# Altium schematic sheet Page E_Micro_SD.SchDoc
size 386 x 246 mm; SheetNumber: 0; SheetTotal: 0
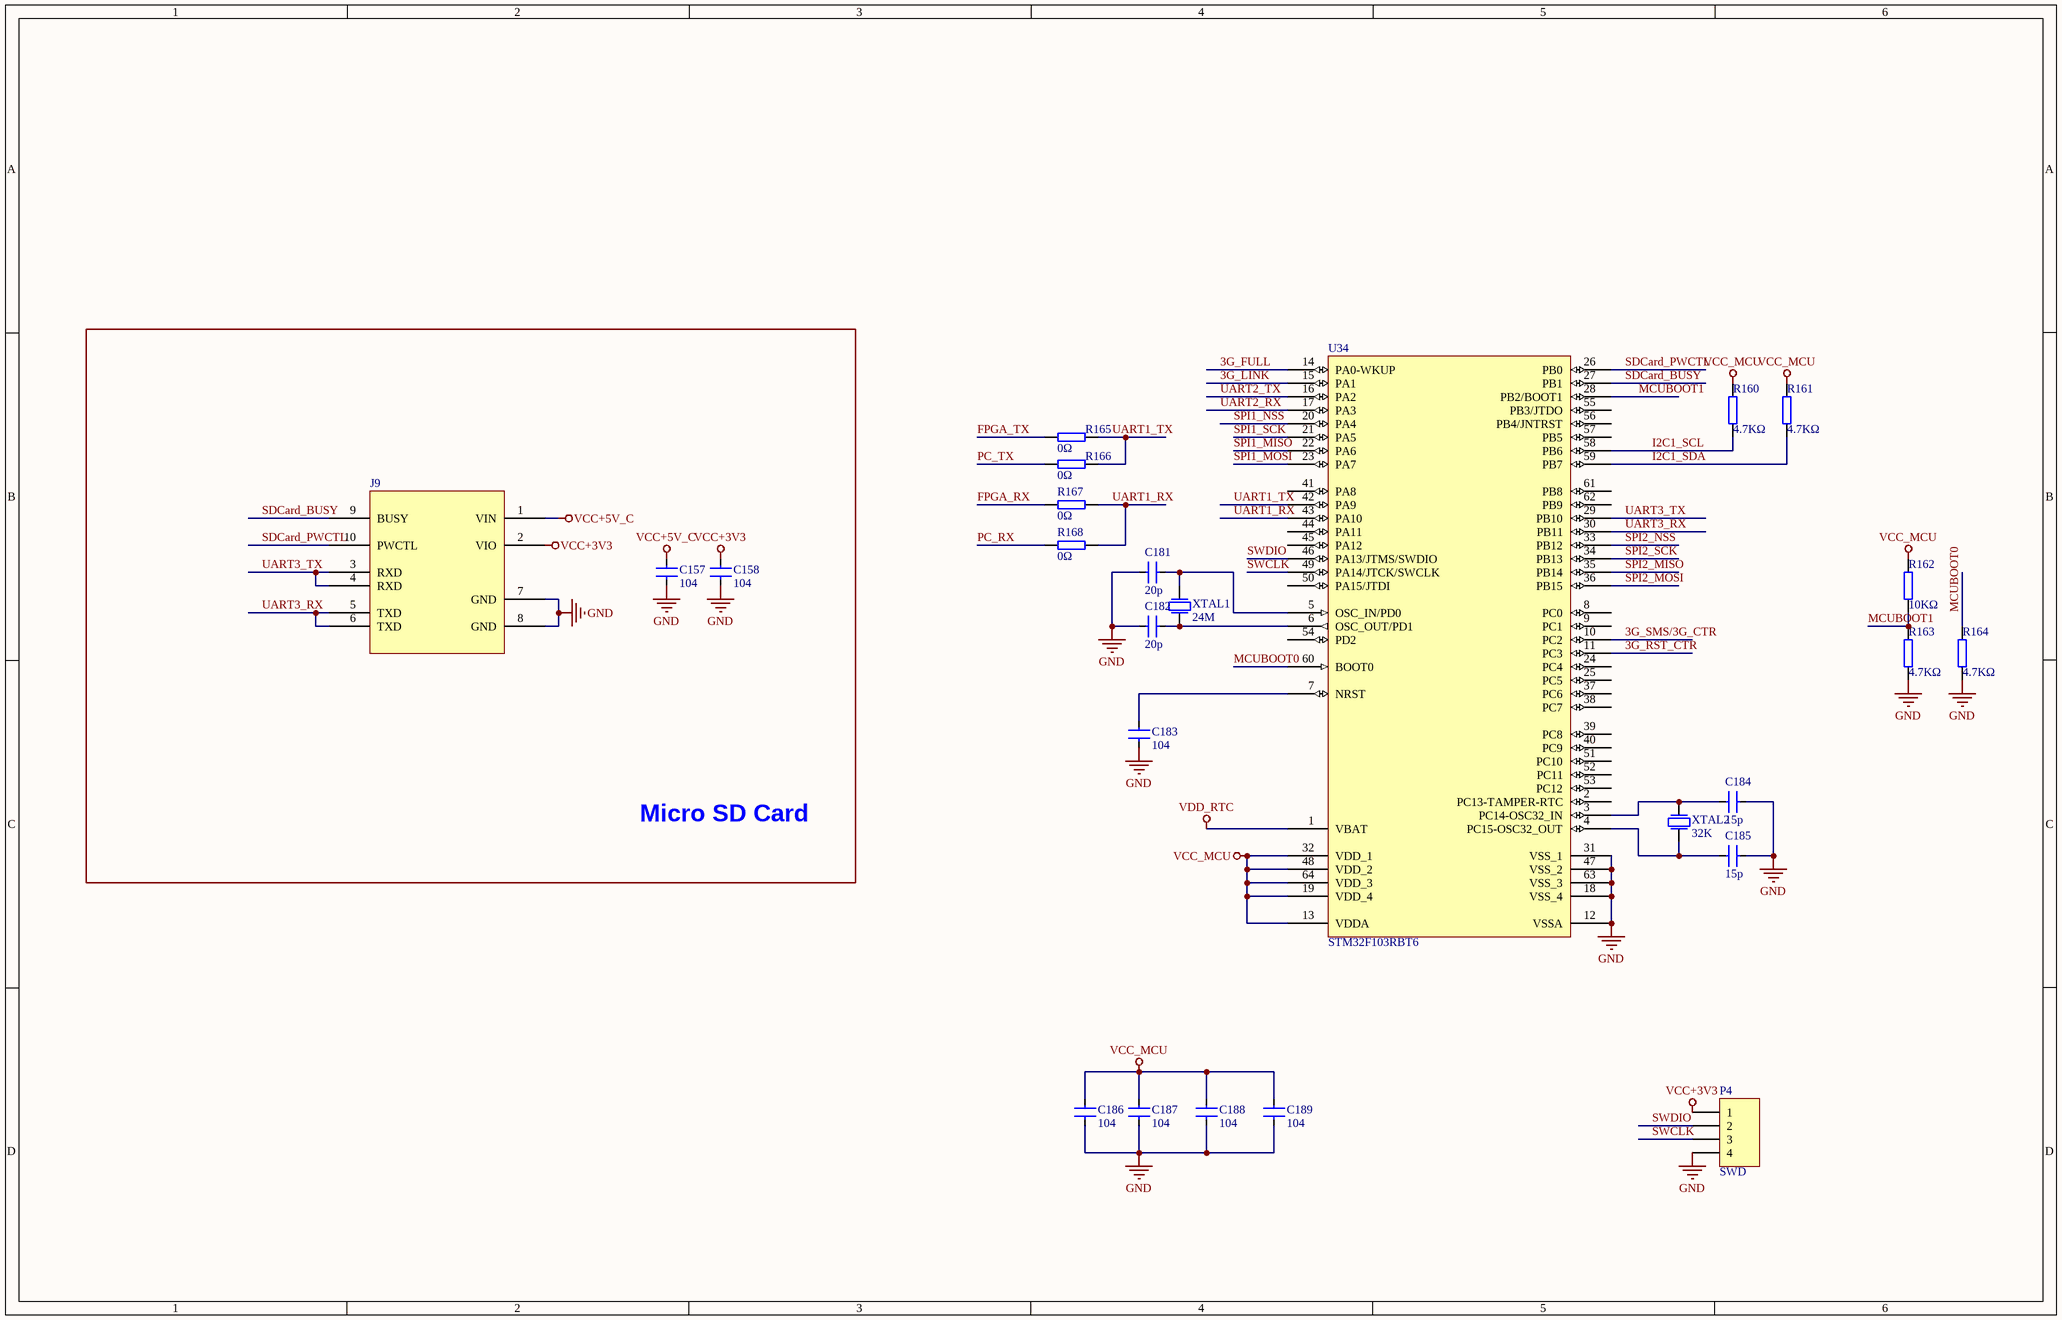
[diagram p0: Page E_Micro_SD.SchDoc]

## Parts
C157  104  [0603C]
C158  104  [0603C]
C181  20p  [0603C]
C182  20p  [0603C]
C183  104  [0603C]
C184  15p  [0603C]
C185  15p  [0603C]
C186  104  [0603C]
C187  104  [0603C]
C188  104  [0603C]
C189  104  [0603C]
J9  SDV600  [JTAG10PW]  (value not drawn)
P4  SWD  [HDR1X4]
R160  4.7KΩ  [0603R]
R161  4.7KΩ  [0603R]
R162  10KΩ  [0603R]
R163  4.7KΩ  [0603R]
R164  4.7KΩ  [0603R]
R165  0Ω  [0603R]
R166  0Ω  [0603R]
R167  0Ω  [0603R]
R168  0Ω  [0603R]
U34  STM32F103RBT6  [LQFP64_N]
XTAL1  24M  [XTAL2]
XTAL2  32K  [XTAL_32.768]

## Blocks framed on the sheet
Micro SD Card: C157 C158 J9

## Nets
GND: C157.1 C158.1 C181.2 C182.2 C183.1 C184.1 C185.1 C186.1 C187.1 C188.1 C189.1 J9.7(GND) J9.8(GND) P4.4 R163.2 R164.2 U34.12(VSSA) U34.18(VSS_4) U34.31(VSS_1) U34.47(VSS_2) U34.63(VSS_3)
VCC+3V3: C158.2 J9.2(VIO) P4.1
VCC+5V_C: C157.2 J9.1(VIN)
VCC_MCU: C186.2 C187.2 C188.2 C189.2 R160.1 R161.1 R162.1 U34.13(VDDA) U34.19(VDD_4) U34.32(VDD_1) U34.48(VDD_2) U34.64(VDD_3)
VDD_RTC: U34.1(VBAT)
3G_FULL: U34.14(PA0-WKUP)
3G_LINK: U34.15(PA1)
3G_RST_CTR: U34.11(PC3)
3G_SMS/3G_CTR: U34.10(PC2)
FPGA_RX: R167.1
FPGA_TX: R165.1
I2C1_SCL: R160.2 U34.58(PB6)
I2C1_SDA: R161.2 U34.59(PB7)
MCUBOOT0: R164.1 U34.60(BOOT0)
MCUBOOT1: R162.2 R163.1 U34.28(PB2/BOOT1)
PC_RX: R168.1
PC_TX: R166.1
SDCard_BUSY: J9.9(BUSY) U34.27(PB1)
SDCard_PWCTL: J9.10(PWCTL) U34.26(PB0)
SPI1_MISO: U34.22(PA6)
SPI1_MOSI: U34.23(PA7)
SPI1_NSS: U34.20(PA4)
SPI1_SCK: U34.21(PA5)
SPI2_MISO: U34.35(PB14)
SPI2_MOSI: U34.36(PB15)
SPI2_NSS: U34.33(PB12)
SPI2_SCK: U34.34(PB13)
SWCLK: P4.3 U34.49(PA14/JTCK/SWCLK)
SWDIO: P4.2 U34.46(PA13/JTMS/SWDIO)
UART1_RX: R167.2 R168.2 U34.43(PA10)
UART1_TX: R165.2 R166.2 U34.42(PA9)
UART2_RX: U34.17(PA3)
UART2_TX: U34.16(PA2)
UART3_RX: J9.5(TXD) J9.6(TXD) U34.30(PB11)
UART3_TX: J9.3(RXD) J9.4(RXD) U34.29(PB10)
NetC181_1: C181.1 U34.5(OSC_IN/PD0) XTAL1.1(P1)
NetC182_1: C182.1 U34.6(OSC_OUT/PD1) XTAL1.2(P2)
NetC183_2: C183.2 U34.7(NRST)
NetC184_2: C184.2 U34.3(PC14-OSC32_IN) XTAL2.1(P1)
NetC185_2: C185.2 U34.4(PC15-OSC32_OUT) XTAL2.2(P2)

Not connected (* = marked no-connect by the designer): U34 2(PC13-TAMPER-RTC) 8(PC0) 9(PC1) 24(PC4) 25(PC5) 37(PC6) 38(PC7) 39(PC8) 40(PC9) 41(PA8) 44(PA11) 45(PA12) 50(PA15/JTDI) 51(PC10) 52(PC11) 53(PC12) 54(PD2) 55(PB3/JTDO) 56(PB4/JNTRST) 57(PB5) 61(PB8) 62(PB9)

## Library data of the parts
C157 C158 C181-C189 = C-X5R/X7R
J9 = Uart0_SDCard
P4 = Header 4: Header, 4-Pin; LatestRevisionDate: 17-Jul-2002; LatestRevisionNote: Re-released for DXP Platform.; Publisher: Altium Limited
R160-R168 = 1K-0805R: Value: 1K
U34 = STM32F103RBT6: STM32 ARM-based 32-bit MCU with 128 Kbytes Flash, 64-pin LQFP, Industrial Temperature; Published: 30-May-2008; DatasheetVersion: rev6, Mar-2008; PackageVersion: Mar-2008; PackageReference: LQFP64; Publisher: Altium Limited; PackageDescription: 64-Pin Low-Profile Quad Flat Pack, 10 x 10 mm Body, 0.5 mm Pitch (LQFP64); ComponentLink1Description: Manufacturer Link; ComponentLink1URL: www.st.com/stm32; ComponentLink2Description: Datasheet; ComponentLink2URL: http://www.st.com/stonline/products/literature/ds/13587.pdf
XTAL1 XTAL2 = XTAL: CRYSTAL